# EAGLE design TimeSquared1.1 (EAGLE 5.06)
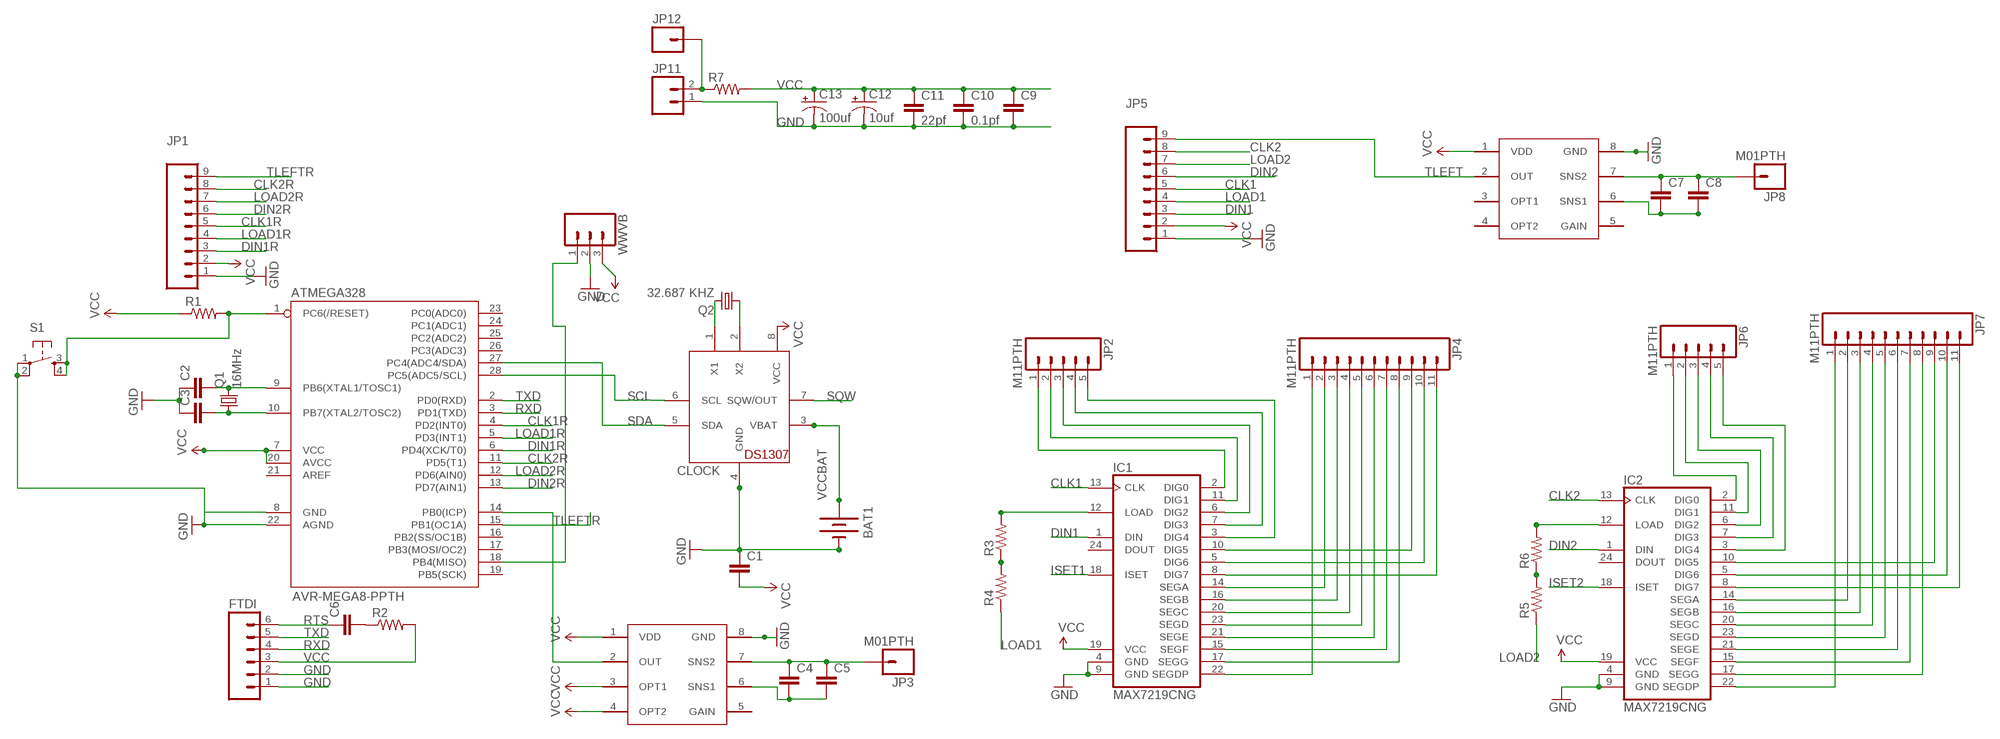
[diagram p0: schematic, sheet 1]

## Parts
ATMEGA328  AVR-MEGA8-PPTH  [DIL28-3]
BAT1  BATTERY20PTH  [BATTCOM_20MM_PTH]
C1  CAPPTH2  [CAP-PTH-SMALL2]
C2  CAPPTH2  [CAP-PTH-SMALL2]
C3  CAPPTH2  [CAP-PTH-SMALL2]
C4  CAPPTH1  [CAP-PTH-5MM]
C5  CAPPTH3  [CAP-PTH-LARGE]
C6  CAPPTH1  [CAP-PTH-5MM]
C7  CAPPTH1  [CAP-PTH-5MM]
C8  CAPPTH3  [CAP-PTH-LARGE]
C9  CAPPTH1  [CAP-PTH-5MM]
C10  0.1pf  CAPPTH1  [CAP-PTH-5MM]
C11  22pf  CAPPTH1  [CAP-PTH-5MM]
C12  10uf  CAP_POLPTH2  [CPOL-RADIAL-10UF-25V]
C13  100uf  CAP_POLPTH2  [CPOL-RADIAL-10UF-25V]
CLOCK  DS1307  [DIL08]
FTDI  M06SIP  [1X06]
IC1  MAX7219CNG  [DIL24-3]
IC2  MAX7219CNG  [DIL24-3]
JP1  M09  [1X09]
JP2  M11PTH  M05PTH  [1X05]
JP3  M01PTH  [1X01]
JP4  M11PTH  [1X11]
JP5  M09  [1X09]
JP6  M11PTH  M05PTH  [1X05]
JP7  M11PTH  [1X11]
JP8  M01PTH  [1X01]
JP11  M02PTH  [1X02]
JP12  M01PTH  [1X01]
Q1  16MHz  CRYSTALHC49U70  [HC49U70]
Q2  32.687 KHZ  CRYSTALTC26H  [TC26H]
R1  RESISTORPTH1  [AXIAL-0.3]
R2  RESISTORPTH1  [AXIAL-0.3]
R3  RESISTORPTH1  [AXIAL-0.3]
R4  RESISTORPTH1  [AXIAL-0.3]
R5  RESISTORPTH1  [AXIAL-0.3]
R6  RESISTORPTH1  [AXIAL-0.3]
R7  RESISTORPTH1  [AXIAL-0.3]
S1  TAC_SWITCHPTH  [TACTILE-PTH]
U$1  QT118  QT118H  [QT118H]
U$5  QT118  QT118H  [QT118H]
WWVB  M03POLAR  [MOLEX-1X3]

## Nets
CLK1: IC1.13(CLK) JP5.5
CLK1R: ATMEGA328.4(PD2(INT0)) JP1.5
CLK2: IC2.13(CLK) JP5.8
CLK2R: ATMEGA328.11(PD5(T1)) JP1.8
DIN1: IC1.1(DIN) JP5.3
DIN1R: ATMEGA328.6(PD4(XCK/T0)) JP1.3
DIN2: IC2.1(DIN) JP5.6
DIN2R: ATMEGA328.13(PD7(AIN1)) JP1.6
GND: ATMEGA328.8(GND) ATMEGA328.22(AGND) BAT1.2(-) C1.1 C2.1 C3.1 C9.2 C10.2 C11.2 C12.2(-) C13.2(-) CLOCK.4(GND) FTDI.1 FTDI.2 IC1.4(GND) IC1.9(GND) IC2.4(GND) IC2.9(GND) JP1.1 JP5.1 JP11.1 S1.1 S1.2 U$1.8(GND) U$5.8(GND) WWVB.2
ISET1: IC1.18(ISET)
ISET2: IC2.18(ISET)
LOAD1: JP5.4 R4.P$1
LOAD1R: ATMEGA328.5(PD3(INT1)) JP1.4
LOAD2: JP5.7 R5.P$1
LOAD2R: ATMEGA328.12(PD6(AIN0)) JP1.7
N$1: ATMEGA328.1(PC6(/RESET)) R1.P$2 S1.3 S1.4
N$2: ATMEGA328.10(PB7(XTAL2/TOSC2)) C3.2 Q1.1
N$3: ATMEGA328.9(PB6(XTAL1/TOSC1)) C2.2 Q1.2
N$4: IC1.2(DIG0) JP2.1
N$5: CLOCK.2(X2) Q2.1
N$6: CLOCK.1(X1) Q2.2
N$7: ATMEGA328.14(PB0(ICP)) U$5.2(OUT)
N$8: C4.1 C5.1 JP3.1 U$5.7(SNS2)
N$9: ATMEGA328.18(PB4(MISO)) WWVB.1
N$10: C4.2 C5.2 U$5.6(SNS1)
N$11: IC1.11(DIG1) JP2.2
N$12: IC1.6(DIG2) JP2.3
N$13: IC1.7(DIG3) JP2.4
N$14: C6.2 R2.P$1
N$15: IC1.3(DIG4) JP2.5
N$16: IC1.14(SEGA) JP4.2
N$17: IC1.16(SEGB) JP4.3
N$18: IC1.20(SEGC) JP4.4
N$19: IC1.23(SEGD) JP4.5
N$20: IC1.21(SEGE) JP4.6
N$21: IC1.15(SEGF) JP4.7
N$22: IC1.17(SEGG) JP4.8
N$23: IC1.10(DIG5) JP4.9
N$24: IC1.5(DIG6) JP4.10
N$25: IC1.8(DIG7) JP4.11
N$26: IC1.12(LOAD) R3.P$2
N$27: R3.P$1 R4.P$2
N$28: R5.P$2 R6.P$1
N$29: IC2.12(LOAD) R6.P$2
N$30: IC2.2(DIG0) JP6.1
N$31: IC2.11(DIG1) JP6.2
N$32: IC2.6(DIG2) JP6.3
N$33: IC2.7(DIG3) JP6.4
N$34: IC2.3(DIG4) JP6.5
N$35: IC2.14(SEGA) JP7.2
N$36: IC2.20(SEGC) JP7.4
N$37: IC2.16(SEGB) JP7.3
N$38: IC2.23(SEGD) JP7.5
N$39: IC2.21(SEGE) JP7.6
N$40: IC2.15(SEGF) JP7.7
N$41: IC2.17(SEGG) JP7.8
N$42: IC2.22(SEGDP) JP7.1
N$43: IC1.22(SEGDP) JP4.1
N$44: IC2.10(DIG5) JP7.9
N$45: IC2.5(DIG6) JP7.10
N$46: IC2.8(DIG7) JP7.11
N$48: C7.1 C8.1 JP8.1 U$1.7(SNS2)
N$49: C7.2 C8.2 U$1.6(SNS1)
N$50: JP11.2 JP12.1 R7.P$1
RTS: C6.1 FTDI.6
RXD: ATMEGA328.3(PD1(TXD)) FTDI.4
SCL: ATMEGA328.28(PC5(ADC5/SCL)) CLOCK.6(SCL)
SDA: ATMEGA328.27(PC4(ADC4/SDA)) CLOCK.5(SDA)
SQW: CLOCK.7(SQW/OUT)
TLEFT: JP5.9 U$1.2(OUT)
TLEFTR: ATMEGA328.15(PB1(OC1A)) JP1.9
TXD: ATMEGA328.2(PD0(RXD)) FTDI.5
VCC: ATMEGA328.7(VCC) ATMEGA328.20(AVCC) C1.2 C9.1 C10.1 C11.1 C12.1(+) C13.1(+) CLOCK.8(VCC) FTDI.3 IC1.19(VCC) IC2.19(VCC) JP1.2 JP5.2 R1.P$1 R2.P$2 R7.P$2 U$1.1(VDD) U$5.1(VDD) U$5.3(OPT1) U$5.4(OPT2) WWVB.3
VCCBAT: BAT1.1(+) CLOCK.3(VBAT)
Unconnected: ATMEGA328.16(PB2(SS/OC1B)) ATMEGA328.17(PB3(MOSI/OC2)) ATMEGA328.19(PB5(SCK)) ATMEGA328.21(AREF) ATMEGA328.23(PC0(ADC0)) ATMEGA328.24(PC1(ADC1)) ATMEGA328.25(PC2(ADC2)) ATMEGA328.26(PC3(ADC3)) IC1.24(DOUT) IC2.24(DOUT) U$1.3(OPT1) U$1.4(OPT2) U$1.5(GAIN) U$5.5(GAIN)

## Library data of the parts
ATMEGA328 = _SparkFun 12:09 :AVR-MEGA8-P: MICROCONTROLLER 8 Kbytes FLASH 1 kbytes SRAM 512 bytes EEPROM USART 4-channel 10 bit ADC 2-channel 8 bit ADC
BAT1 = _SparkFun 12:09 :BATTERY: Battery Holders
C1-C11 = _SparkFun 12:09 :CAP: Capacitor
C12 C13 = _SparkFun 12:09 :CAP_POL: Capacitor Polarized
CLOCK = _adafruit 3:10:DS1307: DS1307 Real time clock (RTC) with battery backup ability. Talk to it via i2c
FTDI = _SparkFun 12:09 :M06: Header 6 Standard 6-pin 0.1" header. Use with straight break away headers (SKU : PRT-00116), right angle break away headers (PRT-00553), swiss pins (PRT-00743), machine pins (PRT-00117), and female headers (PRT-00115). Molex polarized connector foot print use with SKU : PRT-08094 with associated ...
IC1 IC2 = maxim:MAX7219CNG: LED DISPLAY DRIVER
JP1 JP5 = _SparkFun 12:09 :M09: Header 9 Standard 9-pin 0.1" header. Use with straight break away headers (SKU : PRT-00116), right angle break away headers (PRT-00553), swiss pins (PRT-00743), machine pins (PRT-00117), and female headers (PRT-00115).
JP2 JP6 = _SparkFun 12:09 :M05: Header 5 Standard 5-pin 0.1" header. Use with straight break away headers (SKU : PRT-00116), right angle break away headers (PRT-00553), swiss pins (PRT-00743), machine pins (PRT-00117), and female headers (PRT-00115). Molex polarized connector foot print use with SKU : PRT-08230 with associated ...
JP3 JP8 JP12 = _SparkFun 12:09 :M01: Header 1
JP4 JP7 = _SparkFun 12:09 :M11: Header 11 Standard 11-pin 0.1" header. Use with straight break away headers (SKU : PRT-00116), right angle break away headers (PRT-00553), swiss pins (PRT-00743), machine pins (PRT-00117), and female headers (PRT-00115).
JP11 = _SparkFun 12:09 :M02: Header 2
Q1 Q2 = crystal:CRYSTAL: CRYSTAL
R1-R7 = _SparkFun 12:09 :RESISTOR: Resistor
S1 = _SparkFun 12:09:TAC_SWITCH: Momentary Switch Button commonly used for reset or general input. Spark Fun Electronics SKU : COM-00097
U$1 U$5 = _Spencers Library:QT118
WWVB = _SparkFun 12:09 :M03: Header 3 Standard 3-pin 0.1" header. Use with straight break away headers (SKU : PRT-00116), right angle break away headers (PRT-00553), swiss pins (PRT-00743), machine pins (PRT-00117), and female headers (PRT-00115). Molex polarized connector foot print use with SKU : PRT-08232 with associated ...

## Board
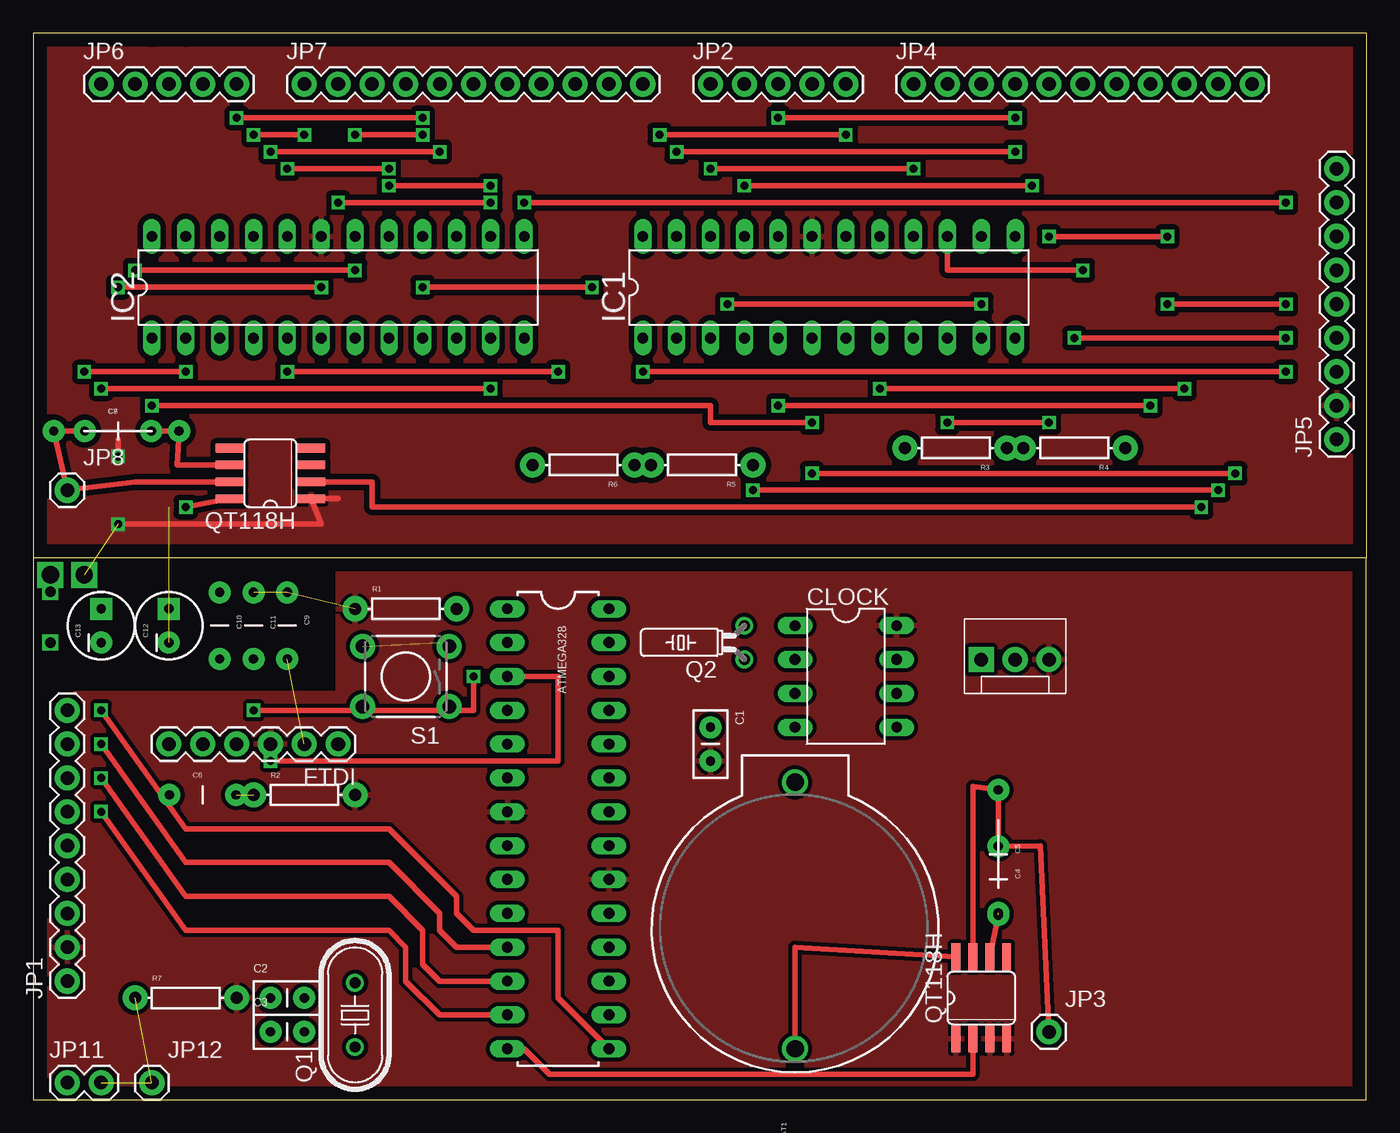
[diagram p1: board, top side]
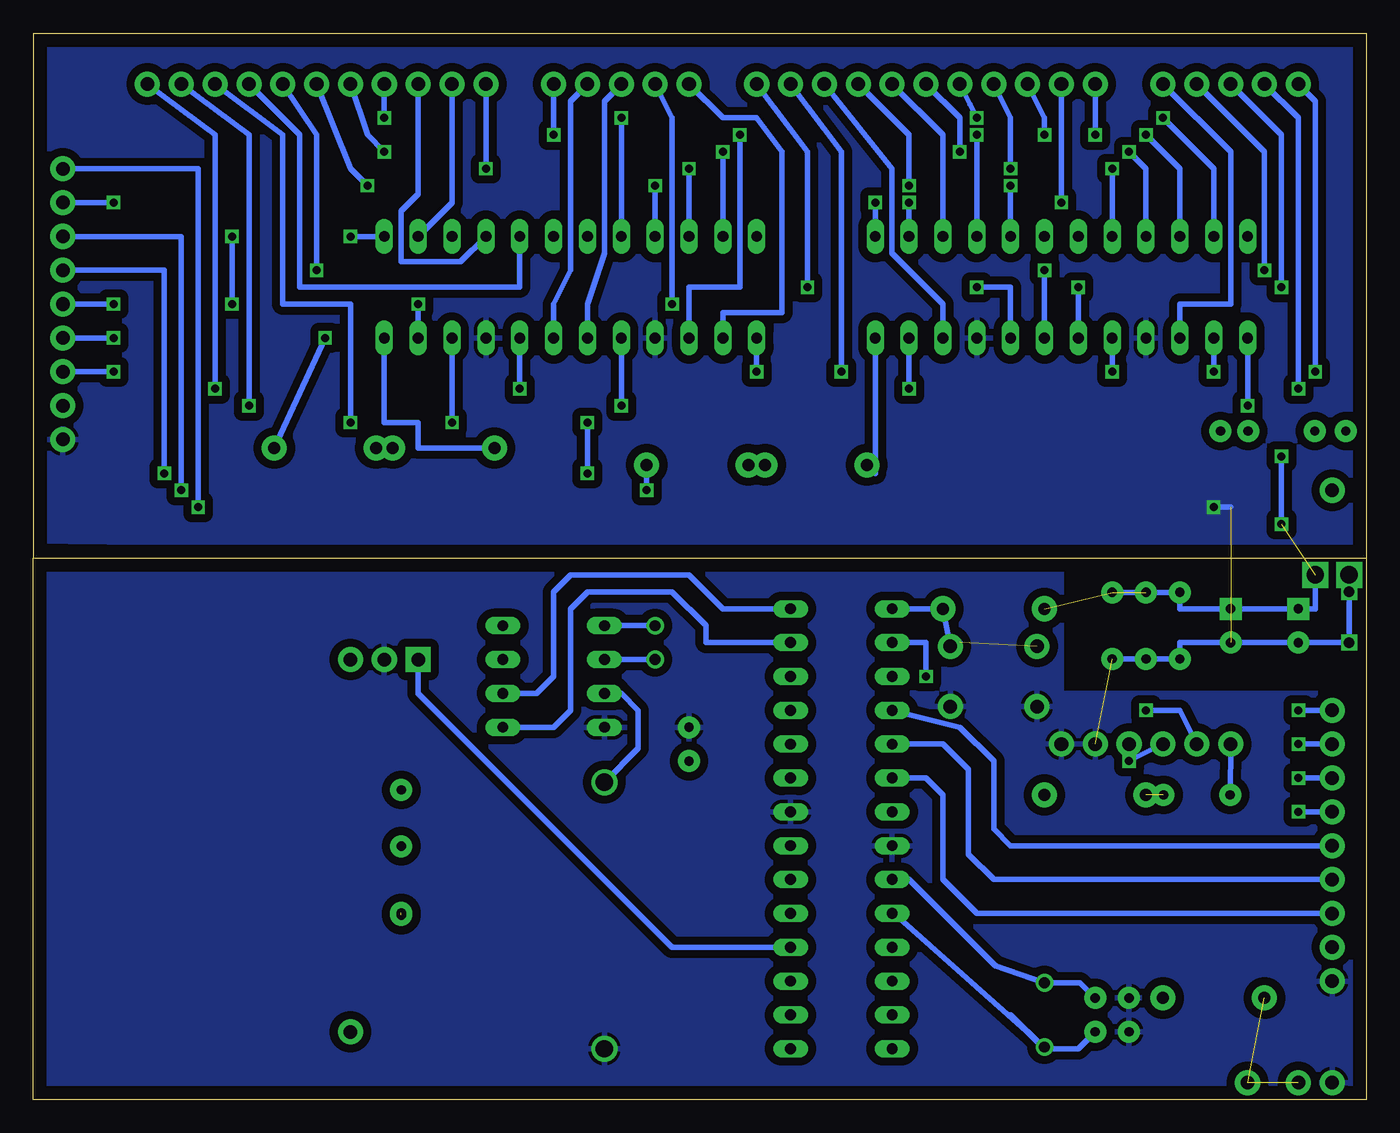
[diagram p2: board, bottom side, seen from below]

Size 100.01 x 80.01 mm. Coordinates in mm from the lower left corner, seen from the top.
Outline: 100.01,40.63 100.01,0 0.01,0 0.01,40.63
Outline: 100.01,40.63 100.01,80 11.44,80.01 8.9,80.01 0,80 0.01,40.63
Outline: 100.01,40.63 0.01,40.63
Copper layers (1*16): Top 0.035mm / dielectric 1.5mm / Bottom 0.035mm
Design rules "default": minimum track width 10mil, minimum drill 24mil, track to track 8mil, track to pad 8mil, pad to pad 8mil, via to via 8mil, smd to smd 8mil, copper to edge 40mil, drill to drill 8mil, minimum pad ring 10mil, minimum via ring 8mil, stop-mask expansion 4mil, vias tented up to drill 0mil, thermal gap 10mil

### Footprints (pad centres in the part's own frame; a part is rotated, then mirrored left to right if it is on the bottom)
DIL28-3 = drill 0.813 long: 1 -16.51,-3.81; 2 -13.97,-3.81; 3 -11.43,-3.81; 4 -8.89,-3.81; 5 -6.35,-3.81; 6 -3.81,-3.81; 7 -1.27,-3.81; 8 1.27,-3.81; 9 3.81,-3.81; 10 6.35,-3.81; 11 8.89,-3.81; 12 11.43,-3.81; 13 13.97,-3.81; 14 16.51,-3.81; 15 16.51,3.81; 16 13.97,3.81; 17 11.43,3.81; 18 8.89,3.81; 19 6.35,3.81; 20 3.81,3.81; 21 1.27,3.81; 22 -1.27,3.81; 23 -3.81,3.81; 24 -6.35,3.81; 25 -8.89,3.81; 26 -11.43,3.81; 27 -13.97,3.81; 28 -16.51,3.81
BATTCOM_20MM_PTH = drill 1.3 round: 1 20,0; 2 0,0
CAP-PTH-SMALL2 = drill 0.7 pad 1.651 round: 1 0,0; 2 2.54,0
CAP-PTH-5MM = drill 0.7 pad 1.651 round: 1 -2.5,0; 2 2.5,0
CAP-PTH-LARGE = drill 0.7 pad 1.651 round: 1 -4.826,0; 2 4.572,0
CPOL-RADIAL-10UF-25V = drill 0.7 pad 1.651 square: 1 1.27,0 | drill 0.7 pad 1.651 round: 2 -1.27,0
DIL08 = drill 0.813 long: 1 -3.81,-3.81; 2 -1.27,-3.81; 3 1.27,-3.81; 4 3.81,-3.81; 5 3.81,3.81; 6 1.27,3.81; 7 -1.27,3.81; 8 -3.81,3.81
1X06 = drill 1.016 pad 1.88 round: 1 0,0; 2 2.54,0; 3 5.08,0; 4 7.62,0; 5 10.16,0; 6 12.7,0
DIL24-3 = drill 0.813 long: 1 -13.97,-3.81; 2 -11.43,-3.81; 3 -8.89,-3.81; 4 -6.35,-3.81; 5 -3.81,-3.81; 6 -1.27,-3.81; 7 1.27,-3.81; 8 3.81,-3.81; 9 6.35,-3.81; 10 8.89,-3.81; 11 11.43,-3.81; 12 13.97,-3.81; 13 13.97,3.81; 14 11.43,3.81; 15 8.89,3.81; 16 6.35,3.81; 17 3.81,3.81; 18 1.27,3.81; 19 -1.27,3.81; 20 -3.81,3.81; 21 -6.35,3.81; 22 -8.89,3.81; 23 -11.43,3.81; 24 -13.97,3.81
1X09 = drill 1.016 pad 1.88 round: 1 0,0; 2 2.54,0; 3 5.08,0; 4 7.62,0; 5 10.16,0; 6 12.7,0; 7 15.24,0; 8 17.78,0; 9 20.32,0
1X05 = drill 1.016 pad 1.88 round: 1 0,0; 2 2.54,0; 3 5.08,0; 4 7.62,0; 5 10.16,0
1X01 = drill 1.016 pad 1.88 round: 1 0,0
1X11 = drill 1.016 pad 1.88 round: 1 0,0; 2 2.54,0; 3 5.08,0; 4 7.62,0; 5 10.16,0; 6 12.7,0; 7 15.24,0; 8 17.78,0; 9 20.32,0; 10 22.86,0; 11 25.4,0
1X02 = drill 1.016 pad 1.88 round: 1 0,0; 2 2.54,0
HC49U70 = drill 0.813 round: 1 -2.413,0; 2 2.413,0
TC26H = drill 0.813 round: 1 -1.27,0; 2 1.27,0
AXIAL-0.3 = drill 0.9 pad 1.88 round: P$1 -3.81,0; P$2 3.81,0
TACTILE-PTH = drill 1.016 pad 1.88 round: 1 -3.251,2.261; 2 3.251,2.261; 3 -3.251,-2.261; 4 3.251,-2.261
QT118H = smd 0.66 x 2.032: 1 1.905,2.007; 2 3.175,2.007; 3 4.445,2.007; 4 5.715,2.007; 5 5.715,8.153; 6 4.445,8.153; 7 3.175,8.153; 8 1.905,8.153
MOLEX-1X3 = drill 1.016 pad 1.88 square: 1 0,0 | drill 1.016 pad 1.88 round: 2 2.54,0; 3 5.08,0

### Placement (x,y rotation side)
ATMEGA328  39.38,20.32 270 top
BAT1  57.16,3.81 90 top
C1  50.81,27.94 270 top
C2  17.79,7.62 0 top
C3  17.79,5.08 0 top
C4  72.4,16.51 270 top
C5  72.4,18.41 270 top
C6  12.71,22.86 0 top
C7  6.36,50.16 0 top
C8  6.36,50.16 0 top
C9  19.06,35.56 270 top
C10  13.98,35.56 270 top
C11  16.52,35.56 270 top
C12  10.17,35.56 90 top
C13  5.09,35.56 90 top
CLOCK  60.97,31.75 270 top
FTDI  22.87,26.67 180 top
IC1  59.7,60.96 0 top
IC2  22.87,60.96 0 top
JP1  2.55,8.89 90 top
JP2  50.81,76.2 0 top
JP3  76.21,5.08 0 top
JP4  66.05,76.2 0 top
JP5  97.8,49.53 90 top
JP6  5.09,76.2 0 top
JP7  20.33,76.2 0 top
JP8  2.55,45.72 0 top
JP11  2.55,1.27 0 top
JP12  8.9,1.27 0 top
Q1  24.14,6.35 90 top
Q2  53.35,34.29 90 top
R1  27.95,36.83 0 top
R2  20.33,22.86 0 top
R3  69.23,48.9 180 top
R4  78.12,48.9 180 top
R5  50.17,47.62 180 top
R6  41.28,47.62 180 top
R7  11.44,7.62 0 top
S1  27.95,31.75 180 top
U$1  22.87,43.18 90 top
U$5  67.32,2.54 0 top
WWVB  71.13,33.02 0 top

### Tracks (layer width: path | path; a pad name or v marks a point on that pad's centre or on a via)
CLK1  (via drill 0.6)
  Top 0.406: v76.21,64.77 v85.1,64.77 | v85.1,59.69 v93.99,59.69
  Bottom 0.406: IC1.13 v76.21,64.77 | v85.1,64.77 v85.1,59.69 | v93.99,59.69 JP5.5
CLK1R
  Bottom 0.406: ATMEGA328.4 30.49,27.94 27.95,25.4 27.95,20.32 26.68,19.05 JP1.5
CLK2  (via drill 0.6)
  Top 0.406: v36.84,67.31 v93.99,67.31
  Bottom 0.406: v93.99,67.31 JP5.8 | IC2.13 v36.84,67.31
CLK2R  (via drill 0.6)
  Top 0.406: ATMEGA328.11 31.76,11.43 30.49,12.7 30.49,13.97 26.68,17.78 11.44,17.78 v5.09,26.67
  Bottom 0.406: JP1.8 v5.09,26.67
DIN1  (via drill 0.6)
  Top 0.406: v45.73,54.61 v93.99,54.61
  Bottom 0.406: v45.73,54.61 IC1.1 | v93.99,54.61 JP5.3
DIN1R
  Bottom 0.406: ATMEGA328.6 33.03,24.13 31.76,22.86 31.76,16.51 29.22,13.97 JP1.3
DIN2  (via drill 0.6)
  Top 0.406: v8.9,52.07 50.81,52.07 50.81,50.8 v58.43,50.8 | v58.43,46.99 v90.18,46.99
  Bottom 0.406: JP5.6 90.18,62.23 v90.18,46.99 | v58.43,50.8 v58.43,46.99 | v8.9,52.07 IC2.1
DIN2R  (via drill 0.6)
  Top 0.406: v5.09,21.59 11.44,12.7 26.68,12.7 27.95,11.43 27.95,8.89 30.49,6.35 ATMEGA328.13
  Bottom 0.406: JP1.6 v5.09,21.59
GND  (via drill 0.6, 0.8)  (2 unrouted)
  Top 0.406: U$5.8 57.16,11.43 BAT1.2 | v11.44,44.45 U$1.8
  Bottom 0.406: 1.28,39.37 v1.28,38.1 v1.28,34.29 C13.2 C12.2 13.98,34.29 C10.2 C11.2 C9.2 | v11.44,44.45 10.17,44.45
  pour Bottom (isolate 0.61): 0.01,80.01 100.34,80.01 100.34,41.91 0.01,40.64
  pour Bottom (isolate 0.61): 0.01,0 100.34,0 100.34,40.64 22.87,40.64 22.87,30.48 0.01,30.48
LOAD1  (via drill 0.6)
  Top 0.406: v78.12,57.15 v93.99,57.15
  Bottom 0.406: R4.P$1 v78.12,57.15 | v93.99,57.15 JP5.4
LOAD1R
  Bottom 0.406: ATMEGA328.5 31.76,26.67 29.86,24.77 29.86,18.41 27.95,16.51 JP1.4
LOAD2  (via drill 0.6)
  Top 0.406: v53.98,45.72 v88.91,45.72
  Bottom 0.406: JP5.7 88.91,64.77 v88.91,45.72 | R5.P$1 v53.98,45.72
LOAD2R  (via drill 0.6)
  Top 0.406: ATMEGA328.12 30.49,8.89 29.22,10.16 29.22,12.7 26.68,15.24 11.44,15.24 v5.09,24.13
  Bottom 0.406: JP1.7 v5.09,24.13
N$1  (1 unrouted)
  Bottom 0.406: ATMEGA328.1 R1.P$2 S1.3 31.76,34.29 30.49,34.29
N$2
  Bottom 0.406: ATMEGA328.10 35.44,13.97 Q1.1 26.68,6.35 24.14,3.81 21.6,3.81 C3.2
N$3
  Bottom 0.406: ATMEGA328.9 34.3,16.51 27.82,10.03 Q1.2 21.47,8.76 C2.2
N$4
  Bottom 0.406: JP2.1 48.27,73.66 45.73,73.66 43.82,71.12 43.82,59.05 48.27,59.05 IC1.2
N$5
  Bottom 0.406: Q2.1 CLOCK.2
N$6
  Bottom 0.406: Q2.2 CLOCK.1
N$7
  Top 0.406: ATMEGA328.14 36.84,3.81 38.74,1.91 70.5,1.91 U$5.2
N$8
  Top 0.406: U$5.7 70.5,23.5 C5.1 C4.1 75.58,19.05 JP3.1
N$9
  Bottom 0.406: ATMEGA328.18 52.08,11.43 71.13,30.48 WWVB.1
N$10  (1 unrouted)
  Top 0.406: U$5.6 C5.2
N$11  (via drill 0.6)
  Top 0.406: v52.08,59.69 v71.13,59.69
  Bottom 0.406: IC1.11 71.13,58.42 v71.13,59.69 | JP2.2 52.08,73.66 v52.08,59.69
N$12
  Bottom 0.406: IC1.6 58.43,59.69 57.16,63.5 57.16,74.93 JP2.3
N$13
  Bottom 0.406: IC1.7 60.97,59.69 59.7,62.23 59.7,74.93 JP2.4
N$14  (1 unrouted)
N$15  (via drill 0.6)
  Top 0.406: v47,72.39 v60.97,72.39
  Bottom 0.406: IC1.3 50.81,60.96 47,60.96 v47,72.39 | JP2.5 60.97,73.66 v60.97,72.39
N$16
  Bottom 0.406: JP4.2 68.59,67.31 IC1.14
N$17
  Bottom 0.406: IC1.16 67.95,62.87 72.4,62.87 72.4,66.67 71.13,67.94 JP4.3
N$18  (via drill 0.6)
  Top 0.406: v55.89,73.66 v73.67,73.66
  Bottom 0.406: JP4.4 73.67,74.93 v73.67,73.66 | IC1.20 v55.89,73.66
N$19  (via drill 0.6)
  Top 0.406: v48.27,71.12 v73.67,71.12
  Bottom 0.406: IC1.23 v48.27,71.12 | JP4.5 74.94,72.39 v73.67,71.12
N$20  (via drill 0.6)
  Top 0.406: v53.35,68.58 v74.94,68.58
  Bottom 0.406: IC1.21 v53.35,68.58 | JP4.6 76.21,69.85 v74.94,68.58
N$21  (via drill 0.6)
  Top 0.406: v78.75,62.23 68.59,62.23 IC1.15
  Bottom 0.406: v78.75,62.23 78.75,72.39 JP4.7
N$22
  Bottom 0.406: JP4.8 80.02,72.39 80.02,60.96 63.51,60.96 IC1.17
N$23  (via drill 0.6)
  Top 0.406: v68.59,50.8 v76.21,50.8
  Bottom 0.406: v76.21,50.8 76.21,59.69 81.29,59.69 81.29,72.39 JP4.9 | v68.59,50.8 IC1.10
N$24  (via drill 0.6)
  Top 0.406: v55.89,52.07 v83.83,52.07
  Bottom 0.406: v83.83,52.07 83.83,72.39 JP4.10 | v55.89,52.07 IC1.5
N$25  (via drill 0.6)
  Top 0.406: v63.51,53.34 v86.37,53.34
  Bottom 0.406: v86.37,53.34 86.37,72.39 JP4.11 | v63.51,53.34 IC1.8
N$26
  Bottom 0.406: IC1.12 73.67,50.8 71.13,50.8 71.13,48.9 R3.P$2
N$27
  Bottom 0.406: R3.P$1 R4.P$2
N$28
  Bottom 0.406: R6.P$1 R5.P$2
N$29
  Bottom 0.406: IC2.12 36.84,46.99 R6.P$2
N$30  (via drill 0.6)
  Top 0.406: v3.82,54.61 v11.44,54.61
  Bottom 0.406: JP6.1 3.82,74.93 v3.82,54.61 | v11.44,54.61 IC2.2
N$31  (via drill 0.6)
  Top 0.406: v5.09,53.34 v34.3,53.34
  Bottom 0.406: v5.09,53.34 5.09,73.66 JP6.2 | v34.3,53.34 IC2.11
N$32  (via drill 0.6)
  Top 0.406: v6.36,60.96 v21.6,60.96
  Bottom 0.406: JP6.3 6.36,72.39 v6.36,60.96 | v21.6,60.96 IC2.6
N$33  (via drill 0.6)
  Top 0.406: v7.63,62.23 v24.14,62.23
  Bottom 0.406: JP6.4 7.63,71.12 v7.63,62.23 | v24.14,62.23 IC2.7
N$34
  Bottom 0.406: JP6.5 10.17,71.12 10.17,59.69 13.98,59.69 IC2.3
N$35  (via drill 0.6)
  Top 0.406: v22.87,67.31 v34.3,67.31
  Bottom 0.406: v22.87,67.31 JP7.2 | v34.3,67.31 IC2.14 v34.3,67.31
N$36  (via drill 0.6)
  Top 0.406: v19.06,69.85 v26.68,69.85
  Bottom 0.406: IC2.20 v19.06,69.85 | JP7.4 26.68,73.66 v26.68,69.85
N$37  (via drill 0.6)
  Top 0.406: v29.22,72.39 v24.14,72.39
  Bottom 0.406: JP7.3 24.14,73.66 v24.14,72.39 | IC2.16 29.22,66.04 v29.22,72.39
N$38  (via drill 0.6)
  Top 0.406: v15.25,73.66 v29.22,73.66
  Bottom 0.406: IC2.23 11.44,69.85 v15.25,73.66 | JP7.5 29.73,74.68 v29.22,73.66
N$39  (via drill 0.6)
  Top 0.406: v17.79,71.12 v30.49,71.12
  Bottom 0.406: IC2.21 16.52,69.85 v17.79,71.12 | JP7.6 30.49,73.66 30.49,72.39 v30.49,71.12
N$40
  Bottom 0.406: IC2.15 31.76,72.39 JP7.7
N$41  (via drill 0.6)
  Top 0.406: v26.68,68.58 v34.3,68.58
  Bottom 0.406: IC2.17 v26.68,68.58 | JP7.8 34.3,72.39 v34.3,68.58
N$42  (via drill 0.6)
  Top 0.406: v16.52,72.39 v20.33,72.39
  Bottom 0.406: IC2.22 13.98,69.85 v16.52,72.39 | JP7.1 20.33,73.66 v20.33,72.39
N$43  (via drill 0.6)
  Top 0.406: v50.81,69.85 v66.05,69.85
  Bottom 0.406: IC1.22 v50.81,69.85 | JP4.1 66.05,71.12 v66.05,69.85
N$44
  Bottom 0.406: IC2.10 31.76,59.69 35.57,63.5 35.57,69.85 JP7.9
N$45  (via drill 0.6)
  Top 0.406: v19.06,54.61 v39.38,54.61
  Bottom 0.406: v19.06,54.61 IC2.5 | v39.38,54.61 39.38,71.12 JP7.10
N$46  (via drill 0.6)
  Top 0.406: v29.22,60.96 v41.92,60.96
  Bottom 0.406: IC2.8 26.68,60.96 v29.22,60.96 | JP7.11 41.92,71.12 v41.92,60.96
N$47  (via drill 1.3)
  other vias: 3.82,39.37
N$48
  Top 0.406: U$1.7 7.63,46.35 JP8.1 C8.1 C7.1
N$49
  Top 0.406: U$1.6 10.8,47.62 C8.2 C7.2
N$50  (2 unrouted)
N$52  (via drill 1.3)
  other vias: 1.28,39.37
RTS
  Bottom 0.406: C6.1 FTDI.6
RXD  (via drill 0.6)
  Top 0.406: v17.79,25.4 39.38,25.4 39.38,31.75 ATMEGA328.3
  Bottom 0.406: FTDI.4 v17.79,25.4
SCL
  Bottom 0.406: ATMEGA328.28 48.27,36.83 50.81,39.37 59.7,39.37 60.97,38.1 60.97,31.75 62.24,30.48 CLOCK.6
SDA
  Bottom 0.406: ATMEGA328.27 49.54,34.29 49.54,35.56 52.08,38.1 58.43,38.1 59.7,36.83 59.7,29.21 60.97,27.94 CLOCK.5
TLEFT  (via drill 0.6)
  Top 0.406: U$1.2 25.41,46.35 25.41,44.45 v87.64,44.45
  Bottom 0.406: JP5.9 87.64,69.85 v87.64,44.45
TLEFTR  (via drill 0.6)
  Top 0.406: ATMEGA328.15 39.38,7.62 39.38,12.7 33.03,12.7 31.76,13.97 31.76,15.24 26.68,20.32 11.44,20.32 v5.09,29.21
  Bottom 0.406: JP1.9 v5.09,29.21
TXD  (via drill 0.6)
  Top 0.406: v16.52,29.21 33.03,29.21 v33.03,31.75
  Bottom 0.406: FTDI.5 13.98,29.21 v16.52,29.21 | v33.03,31.75 33.03,34.29 ATMEGA328.2
VCC  (via drill 0.6)  (3 unrouted)
  Top 0.406: 22.87,45.09 U$1.1 21.6,43.18 v6.36,43.18 | v6.36,48.26 6.36,49.53
  Bottom 0.406: 3.82,39.37 3.82,36.83 C13.1 C12.1 13.98,36.83 C10.1 C9.1 | v6.36,43.18 v6.36,48.26
  pour Top (isolate 0.305): 0.01,30.48 0.01,0 102.88,0 102.88,40.64 22.87,40.64 22.87,30.48
  pour Top (isolate 0.406): 0.01,80.01 106.69,80.01 106.69,40.64 0.01,40.64
VCCBAT
  Bottom 0.406: CLOCK.3 55.89,30.48 54.62,29.21 54.62,26.35 BAT1.1